# EAGLE design MUV_bme280_pcb (EAGLE 9.1.3)
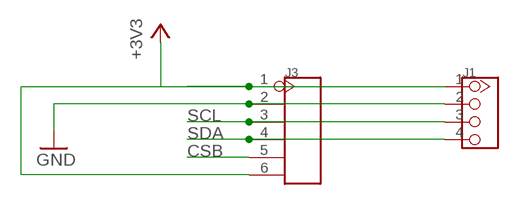
[diagram p0: schematic, sheet 1]

## Parts
J1  TWIG-4P-2.0-2.0  [4P-2.0]
J3  HEADER-6P-80/40MIL  [6P-2.54-80/40MIL]

## Nets
+3V3: J1.1 J3.1 J3.6
CSB: J3.5
GND [power_5V]: J1.2 J3.2
SCL: J1.3 J3.3
SDA: J1.4 J3.4

## Library data of the parts
J1 = Connector:TWIG-4P-2.0
J3 = Connector:HEADER-6P

## Net classes
0 default: width 0.4 mm, clearance 0.7 mm
1 power_5V: width 1 mm, clearance 0.7 mm

## Board
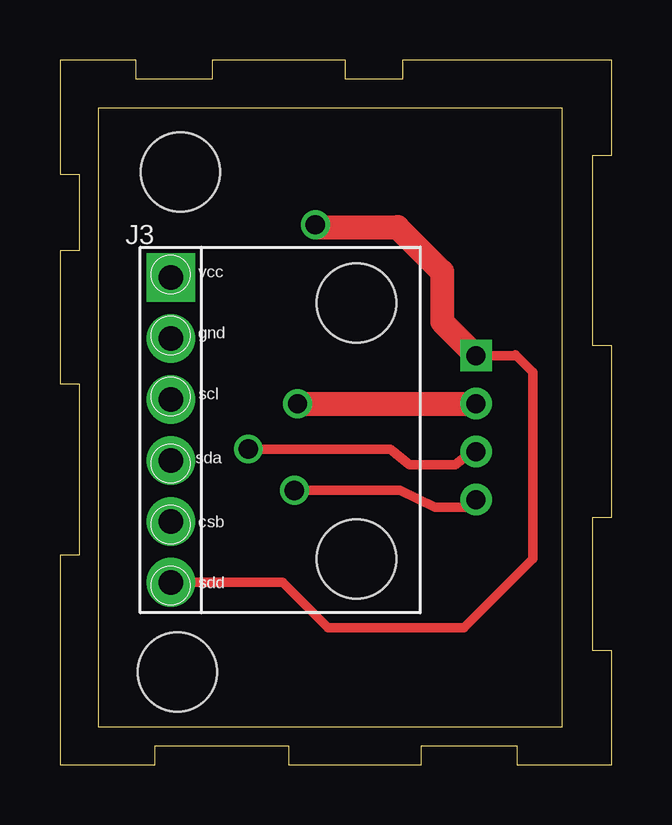
[diagram p1: board, top side]
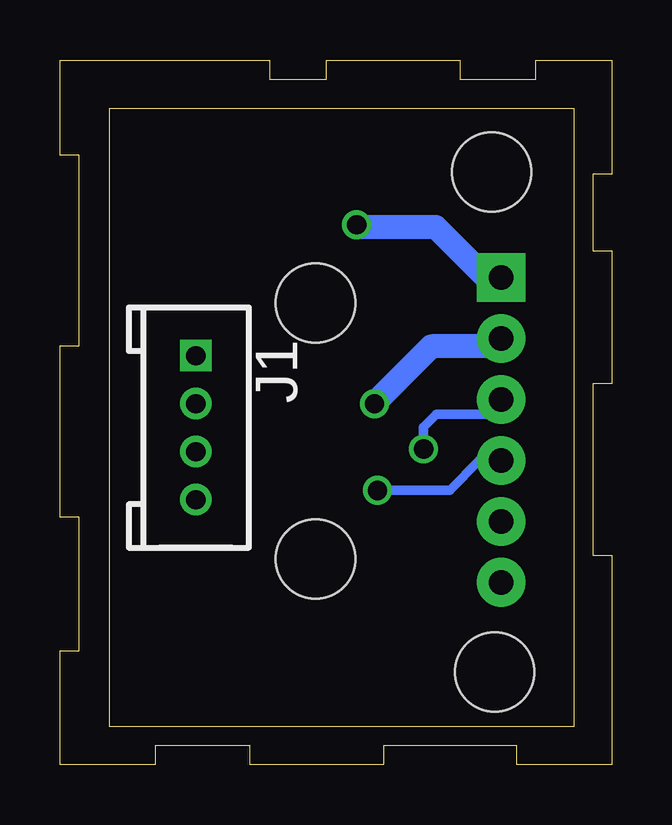
[diagram p2: board, bottom side, seen from below]

Size 23.02 x 29.37 mm. Coordinates in mm from the lower left corner, seen from the top.
Outline: 0.79,0 1.59,0
Outline: 1.59,0 3.97,0 3.97,0.79 9.53,0.79 9.53,0 15.08,0 15.08,0.79 19.05,0.79 19.05,0 23.02,0 23.02,4.76 22.22,4.76 22.22,10.32 23.02,10.32 23.02,17.46 22.22,17.46 22.22,25.4 23.02,25.4 23.02,29.37 19.05,29.37 14.29,29.37 14.29,28.58 11.91,28.58 11.91,29.37 6.35,29.37 6.35,28.58 3.17,28.58 3.17,29.37 1.59,29.37 0,29.37 0,24.61 0.79,24.61 0.79,21.43 0,21.43 0,15.87 0.79,15.87 0.79,8.73 0,8.73 0,0 1.59,0
Outline: 1.59,1.59 20.94,1.59 20.94,27.36 1.59,27.36 1.59,1.59
Copper layers (1*16): Top 0.035mm / dielectric 1.5mm / Bottom 0.035mm
Design rules "default *": minimum track width 6mil, minimum drill 0.35mm, track to track 0.4mm, track to pad 0.4mm, pad to pad 0.4mm, via to via 0.4mm, smd to smd 6mil, copper to edge 40mil, drill to drill 6mil, minimum pad ring 10mil, minimum via ring 8mil, stop-mask expansion 4mil, vias tented up to drill 0mil, thermal gap 10mil
Holes 3.3 mm at 5.02,24.7 12.36,19.24 4.89,3.87 12.36,8.57

### Footprints (pad centres in the part's own frame; a part is rotated, then mirrored left to right if it is on the bottom)
4P-2.0 = drill 0.8 pad 1.27 square: 1 -3,0 | drill 0.8 pad 1.27: 2 -1,0; 3 1,0; 4 3,0
6P-2.54-80/40MIL = drill 1.016 pad 2.032 square: 1 0,6.35 | drill 1.016 pad 2.032: 2 0,3.81; 3 0,1.27; 4 0,-1.27; 5 0,-3.81; 6 0,-6.35

### Placement (x,y rotation side)
J1  17.35,14.05 270 bottom
J3  4.62,13.95 0 top
U$1  [BME280_BO_NOPADS]  3.35,6.33 0 top

### Tracks (layer width: path | path; a pad name or v marks a point on that pad's centre or on a via)
+3V3  (via drill 0.8)
  Top 0.4: J3.6 9.28,7.6 11.18,5.71 16.84,5.71 19.73,8.59 19.73,16.35 18.99,17.09 18.95,17.05 J1.1
  Top 1: J1.1 15.93,18.47 15.93,20.55 14.08,22.41 10.65,22.41 v10.65,22.5
  Bottom 1: J3.1 5.25,20.3 7.35,22.41 10.55,22.41 v10.65,22.5
GND  (via drill 0.8)
  Top 1: v9.9,15.05 J1.2
  Bottom 1: J3.2 4.94,17.44 7.54,17.44 9.9,15.08 v9.9,15.05
SCL  (via drill 0.8)
  Top 0.4: v7.85,13.16 13.02,13.16 13.79,13.16 14.56,12.51 16.49,12.51 17.15,13.05 J1.3
  Bottom 0.4: J3.3 5.24,14.6 7.31,14.6 7.85,14.06 v7.85,13.16
SDA  (via drill 0.8)
  Top 0.4: v9.77,11.43 14.18,11.43 15.63,10.73 17.08,10.73 J1.4
  Bottom 0.4: v9.77,11.43 9.76,11.45 6.75,11.45 5.52,12.68 J3.4